# Altium schematic sheet Sheet1.SchDoc
size A4
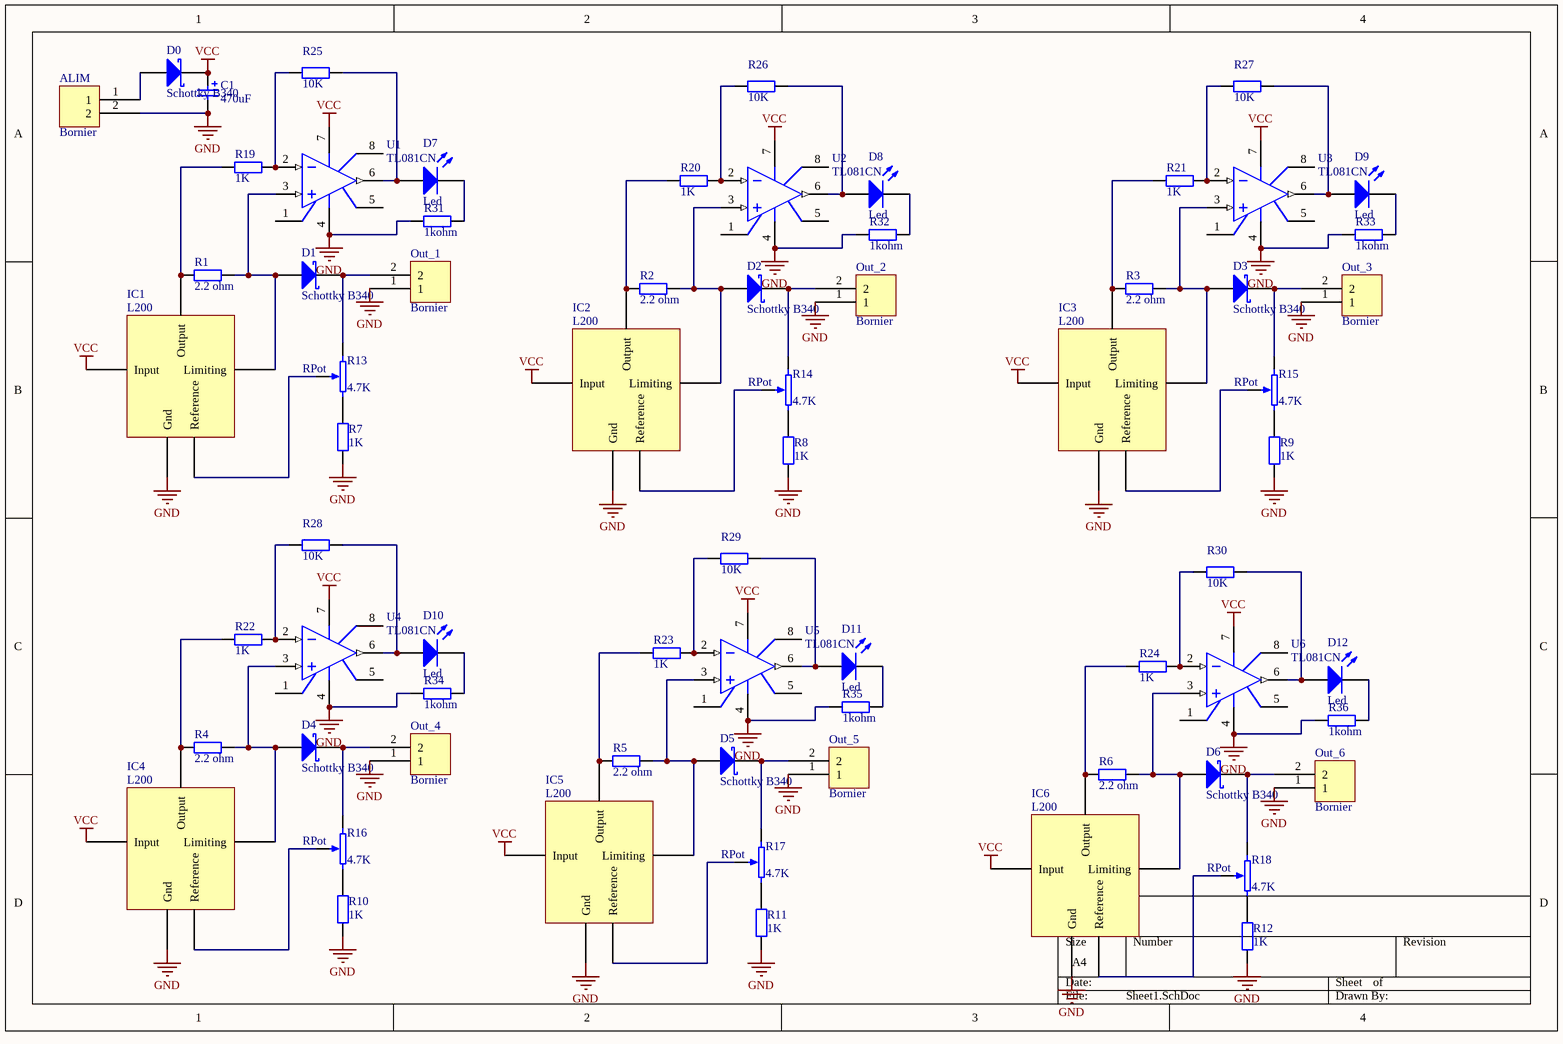
[diagram p0: Sheet1.SchDoc]

## Parts
ALIM  Bornier  [Bornier]
C1  470uF  [Capa_pol1]
D0  Schottky B340  [SMC]
D1  Schottky B340  [SMC]
D2  Schottky B340  [SMC]
D3  Schottky B340  [SMC]
D4  Schottky B340  [SMC]
D5  Schottky B340  [SMC]
D6  Schottky B340  [SMC]
D7  Led  [LED]
D8  Led  [LED]
D9  Led  [LED]
D10  Led  [LED]
D11  Led  [LED]
D12  Led  [LED]
IC1  L200  [Pentawatt]
IC2  L200  [Pentawatt]
IC3  L200  [Pentawatt]
IC4  L200  [Pentawatt]
IC5  L200  [Pentawatt]
IC6  L200  [Pentawatt]
Out_1  Bornier  [Bornier]
Out_2  Bornier  [Bornier]
Out_3  Bornier  [Bornier]
Out_4  Bornier  [Bornier]
Out_5  Bornier  [Bornier]
Out_6  Bornier  [Bornier]
R1  2.2 ohm  [traversant 1/4W]
R2  2.2 ohm  [traversant 1/4W]
R3  2.2 ohm  [traversant 1/4W]
R4  2.2 ohm  [traversant 1/4W]
R5  2.2 ohm  [traversant 1/4W]
R6  2.2 ohm  [traversant 1/4W]
R7  1K  [traversant 1/4W]
R8  1K  [traversant 1/4W]
R9  1K  [traversant 1/4W]
R10  1K  [traversant 1/4W]
R11  1K  [traversant 1/4W]
R12  1K  [traversant 1/4W]
R13  RPot  value 4.7K  [AJUSTABLE]
R14  RPot  value 4.7K  [AJUSTABLE]
R15  RPot  value 4.7K  [AJUSTABLE]
R16  RPot  value 4.7K  [AJUSTABLE]
R17  RPot  value 4.7K  [AJUSTABLE]
R18  RPot  value 4.7K  [AJUSTABLE]
R19  1K  [traversant 1/4W]
R20  1K  [traversant 1/4W]
R21  1K  [traversant 1/4W]
R22  1K  [traversant 1/4W]
R23  1K  [traversant 1/4W]
R24  1K  [traversant 1/4W]
R25  10K  [traversant 1/4W]
R26  10K  [traversant 1/4W]
R27  10K  [traversant 1/4W]
R28  10K  [traversant 1/4W]
R29  10K  [traversant 1/4W]
R30  10K  [traversant 1/4W]
R31  1kohm  [traversant 1/4W]
R32  1kohm  [traversant 1/4W]
R33  1kohm  [traversant 1/4W]
R34  1kohm  [traversant 1/4W]
R35  1kohm  [traversant 1/4W]
R36  1kohm  [traversant 1/4W]
U1  TL081CN  [DIP8]
U2  TL081CN  [DIP8]
U3  TL081CN  [DIP8]
U4  TL081CN  [DIP8]
U5  TL081CN  [DIP8]
U6  TL081CN  [DIP8]

## Nets
GND: ALIM.2 C1.2 IC1.3(Gnd) IC2.3(Gnd) IC3.3(Gnd) IC4.3(Gnd) IC5.3(Gnd) IC6.3(Gnd) Out_1.1 Out_2.1 Out_3.1 Out_4.1 Out_5.1 Out_6.1 R7.1 R8.1 R9.1 R10.1 R11.1 R12.1 R31.1 R32.1 R33.1 R34.1 R35.1 R36.1 U1.4(V-) U2.4(V-) U3.4(V-) U4.4(V-) U5.4(V-) U6.4(V-)
VCC: C1.1 D0.2(K) IC1.1(Input) IC2.1(Input) IC3.1(Input) IC4.1(Input) IC5.1(Input) IC6.1(Input) U1.7(V+) U2.7(V+) U3.7(V+) U4.7(V+) U5.7(V+) U6.7(V+)
NetALIM_1: ALIM.1 D0.1(A)
NetD1_1: D1.1(A) IC1.2(Limiting) R1.1 U1.3(IN+)
NetD1_2: D1.2(K) Out_1.2 R13.3(TOP)
NetD2_1: D2.1(A) IC2.2(Limiting) R2.1 U2.3(IN+)
NetD2_2: D2.2(K) Out_2.2 R14.3(TOP)
NetD3_1: D3.1(A) IC3.2(Limiting) R3.1 U3.3(IN+)
NetD3_2: D3.2(K) Out_3.2 R15.3(TOP)
NetD4_1: D4.1(A) IC4.2(Limiting) R4.1 U4.3(IN+)
NetD4_2: D4.2(K) Out_4.2 R16.3(TOP)
NetD5_1: D5.1(A) IC5.2(Limiting) R5.1 U5.3(IN+)
NetD5_2: D5.2(K) Out_5.2 R17.3(TOP)
NetD6_1: D6.1(A) IC6.2(Limiting) R6.1 U6.3(IN+)
NetD6_2: D6.2(K) Out_6.2 R18.3(TOP)
NetD7_1: D7.1(A) R25.1 U1.6(OUT)
NetD7_2: D7.2(K) R31.2
NetD8_1: D8.1(A) R26.1 U2.6(OUT)
NetD8_2: D8.2(K) R32.2
NetD9_1: D9.1(A) R27.1 U3.6(OUT)
NetD9_2: D9.2(K) R33.2
NetD10_1: D10.1(A) R28.1 U4.6(OUT)
NetD10_2: D10.2(K) R34.2
NetD11_1: D11.1(A) R29.1 U5.6(OUT)
NetD11_2: D11.2(K) R35.2
NetD12_1: D12.1(A) R30.1 U6.6(OUT)
NetD12_2: D12.2(K) R36.2
NetIC1_4: IC1.4(Reference) R13.2(TAP)
NetIC1_5: IC1.5(Output) R1.2 R19.2
NetIC2_4: IC2.4(Reference) R14.2(TAP)
NetIC2_5: IC2.5(Output) R2.2 R20.2
NetIC3_4: IC3.4(Reference) R15.2(TAP)
NetIC3_5: IC3.5(Output) R3.2 R21.2
NetIC4_4: IC4.4(Reference) R16.2(TAP)
NetIC4_5: IC4.5(Output) R4.2 R22.2
NetIC5_4: IC5.4(Reference) R17.2(TAP)
NetIC5_5: IC5.5(Output) R5.2 R23.2
NetIC6_4: IC6.4(Reference) R18.2(TAP)
NetIC6_5: IC6.5(Output) R6.2 R24.2
NetR7_2: R7.2 R13.1(BOT)
NetR8_2: R8.2 R14.1(BOT)
NetR9_2: R9.2 R15.1(BOT)
NetR10_2: R10.2 R16.1(BOT)
NetR11_2: R11.2 R17.1(BOT)
NetR12_2: R12.2 R18.1(BOT)
NetR19_1: R19.1 R25.2 U1.2(IN-)
NetR20_1: R20.1 R26.2 U2.2(IN-)
NetR21_1: R21.1 R27.2 U3.2(IN-)
NetR22_1: R22.1 R28.2 U4.2(IN-)
NetR23_1: R23.1 R29.2 U5.2(IN-)
NetR24_1: R24.1 R30.2 U6.2(IN-)

Not connected (* = marked no-connect by the designer): U1 1(OS_NULL) 5(OS_NULL) 8(NC); U2 1(OS_NULL) 5(OS_NULL) 8(NC); U3 1(OS_NULL) 5(OS_NULL) 8(NC); U4 1(OS_NULL) 5(OS_NULL) 8(NC); U5 1(OS_NULL) 5(OS_NULL) 8(NC); U6 1(OS_NULL) 5(OS_NULL) 8(NC)

## Library data of the parts
ALIM Out_1-Out_6 = Bornier2
C1 = Capa Pol
R1-R12 R19-R36 = Resistance
R13-R18 = RPot: Potentiometer; Sim Note: Enter the Resistance value and the set point into parameter fields.; Set Position: 0.5; Published: 8-Jun-2000; LatestRevisionDate: 17-Jul-2002; LatestRevisionNote: Re-released for DXP Platform.; PackageReference: VR5; Publisher: Altium Limited
U1-U6 = TL081CN: General-Purpose J-FET Single Operational Amplifier; Published: 24-Aug-2001; LatestRevisionDate: 06-Jun-2005; LatestRevisionNote: Stylized 3D Model Added.; DatasheetVersion: Dec-1998; PackageReference: DIP8; Publisher: Altium Limited; PackageDescription: DIP; 8 Leads; Row Spacing 7.62 mm; Pitch 2.54 mm; Code_JEDEC: MO-001-AN; ComponentLink1Description: Manufacturer Link; ComponentLink1URL: http://www.st.com/; ComponentLink2Description: Datasheet; ComponentLink2URL: http://www.st.com/stonline/products/literature/ds/2299/tl081.pdf
D7-D12 = Led: Published: 8-Jun-2000; LatestRevisionDate: 17-Jul-2002; LatestRevisionNote: Re-released for DXP Platform.; DatasheetDocument: 1998; PackageDocument: Aug-1999; PackageReference: DO-41; Publisher: Altium Limited; Code_JEDEC: DO-204-AL; ComponentLink1Description: Manufacturer Link; ComponentLink1URL: http://www.fairchildsemi.com/; ComponentLink2Description: Datasheet; ComponentLink2URL: http://www.fairchildsemi.com/ds/1N%2F1N4001.pdf